# EasyEDA Pro project ProPrj_四轴3.0_2025-12-06.epro, board MPU6050
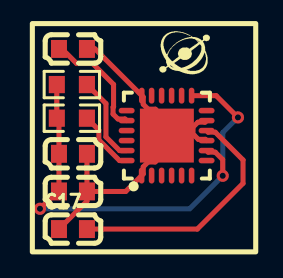
[diagram p10: board, top side]
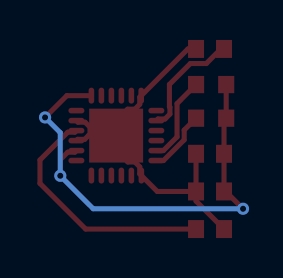
[diagram p11: board, bottom side, seen from below]

No outline. copper layers: Top Layer, Bottom Layer. Coordinates in mm from the lowest, leftmost part position.
Stack: Top Layer 0.035mm / Dielectric1 1.51mm FR4 er 4.5 / Bottom Layer 0.035mm

## Design rules (mm)
template: JLCPCB Capability(Two Layers Board)
spacing copperThickness1oz (default): track to track 0.102, other pairs 0.152 to 0.3
spacing copperThickness2oz: track to track 0.203, other pairs 0.152 to 0.3
track width copperThickness1oz (default): min 0.127, default 0.254, max 2.54
track width copperThickness2oz: min 0.203, default 0.254, max 2.54
differential pair differentialPair (default): width min 0.127, default 0.254, max 2.54; gap min 0.152, default 0.152
via viaSize (default): diameter min 0.5, default 0.61, max 10; hole min 0.3, default 0.305, max 6.3

## Placement (name value [footprint] x y rotation side)
C14  2.2nF  [C0603]  0.06 9.02 180 top
C15  100nF  [C0603]  0.06 1.88 0 top
C16  10nF  [C0603]  0.06 3.77 180 top
C17  100nF  [C0603]  0.06 0 0 top
R7  10kΩ  [R0603]  0 7.23 180 top
R8  10kΩ  [R0603]  0 5.55 180 top
U5  MPU6050-YJLTY  [QFN-24_L4.0-W4.0-P0.50-BL-EP2.7]  4.74 4.68 0 top

## Footprints (pads in the part's own frame, mm; a bottom-side part is the same pattern mirrored in y, then rotated)
C0603
  rect 0.8x0.9 smd: 1(-0.7,0) 2(0.7,0)
QFN-24_L4.0-W4.0-P0.50-BL-EP2.7
  oval 0.28x0.8 smd: 1(-1.25,-2) 2(-0.75,-2) 3(-0.25,-2) 4(0.25,-2) 5(0.75,-2) 6(1.25,-2) 13(1.25,2) 14(0.75,2) 15(0.25,2) 16(-0.25,2) 17(-0.75,2) 18(-1.242,2)
  oval 0.8x0.28 smd: 7(2,-1.25) 8(2,-0.75) 9(2,-0.25) 10(2,0.25) 11(2,0.75) 12(2,1.25) 19(-2,1.25) 20(-2,0.75) 21(-2,0.25) 22(-2,-0.25) 23(-2,-0.75) 24(-2,-1.25)
  rect 2.7x2.7 smd: 25(0.013,0)
R0603
  rect 0.806x0.864 smd: 1(-0.753,0) 2(0.753,0)

## Nets
As in the schematic.

Pads without a net: U5 2 3 4 5 6 7 14 15 16 17 19 21 22

## Via types
v1: diameter 0.61, hole 0.305, Top Layer to Bottom Layer, 3 vias

## Routing (per net, layer and track width the routed paths; a pad name or vN(x,y) marks a point on that pad's centre or on a via; arc(x,y) is an arc through that point)
3V3: length 24.3
  Top Layer w0.254: v1(7.55,2.67) 7.55,3.47 7.17,3.85 6.82,3.85 U5.8 ; v1(-1.6,1.02) -0.73,1.88 C15.1 C16.2 -0.64,5.44 R8.2 R7.2 ; U5.13 7.22,6.68 v1(8.31,5.59)
  Bottom Layer w0.254: v1(-1.6,1.02) 5.9,1.02 v1(7.55,2.67) 7.55,4.83 v1(8.31,5.59)
GND: length 18.7
  Top Layer w0.254: C14.1 1.16,9.02 U5.18 3.57,6.61 3.57,6.25 3.82,6 4.18,6 4.75,5.42 U5.25 4.75,3.94 4.17,3.36 3.82,3.36 3.57,3.11 3.57,2.76 U5.1 2.7,1.88 C15.2 ; U5.11 6.66,5.35 6.31,5.35 6.06,5.1 6.06,4.75 5.99,4.68 6.14,4.68 6.33,4.49 6.68,4.49 U5.9 ; C17.1 0.76,1.4 C15.2 ; C15.2 C16.1
SCL: length 4.3
  Top Layer w0.254: U5.23 2.39,3.93 1.71,4.61 1.71,6.28 R7.1
SDA: length 3.2
  Top Layer w0.254: U5.24 2.39,3.43 1.35,4.46 1.35,4.95 R8.1
$1N581: length 12.4
  Top Layer w0.254: U5.10 6.82,4.85 7.17,4.85 8.56,3.46 8.56,2.29 6.28,0 C17.2
$1N587: length 5.8
  Top Layer w0.254: U5.20 2.66,5.51 2.31,5.51 2.06,5.76 2.06,6.1 2.09,6.13 2.09,7.24 1.04,8.29 0.24,8.29 -0.49,9.02 C14.2
